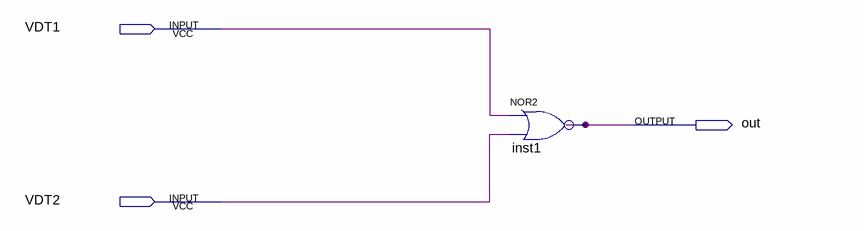
[diagram p0: schematic sheet]
// Quartus schematic assignment4.bdf as structural Verilog: 1 symbols, 3 pins
module assignment4 (
  input  VDT1,
  input  VDT2,
  output out
);

  nor inst1 (out, VDT1, VDT2);
endmodule
